# Altium schematic sheet WiFi.SchDoc
size A4; Organization: Protel International P/L; Address1: L3, 12a Rodborough Rd; Address2: Frenchs Forest; Address3: NSW; Address4: Australia 2086
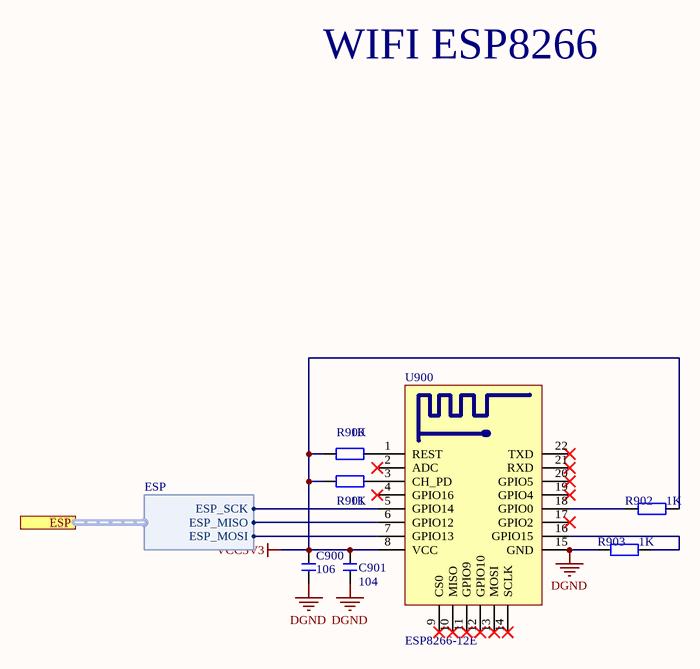
[diagram p0: WiFi.SchDoc]

## Parts
C900  106  [C 0402_M]
C901  104  [C 0402_M]
R900  1K  [R 0402_M]
R901  1K  [R 0402_M]
R902  1K  [R 0402_M]
R903  1K  [R 0402_M]
U900  ESP8266-12E  [ESP_12E]

## Ports
ESP (harness ESP)

## Harnesses
ESP: ESP_SCK, ESP_MISO, ESP_MOSI

## Nets
DGND: C900.1 C901.1 R903.1 U900.15(GND)
VCC3V3: C900.2 C901.2 R900.1 R901.1 R902.2 U900.8(VCC)
NetR900_2: R900.2 U900.1(REST)
NetR901_2: R901.2 U900.3(CH_PD)
NetR902_1: R902.1 U900.18(GPIO0)
NetR903_2: R903.2 U900.16(GPIO15)
NetU900_5: U900.5(GPIO14) ; port ESP.ESP_SCK
NetU900_6: U900.6(GPIO12) ; port ESP.ESP_MISO
NetU900_7: U900.7(GPIO13) ; port ESP.ESP_MOSI

Not connected (* = marked no-connect by the designer): U900 2(ADC)* 4(GPIO16)* 9(CS0)* 10(MISO)* 11(GPIO9)* 12(GPIO10)* 13(MOSI)* 14(SCLK)* 17(GPIO2)* 19(GPIO4)* 20(GPIO5)* 21(RXD)* 22(TXD)*

## Notes on the sheet
- WIFI ESP8266
- Title
- Size:
- Date:
- A4
- Number:
- Time:
- Revision:
- Sheet
- of
- File:

## Library data of the parts
C900 C901 = C: 无极性贴片电容; 版权归属: 源创客; BOM名称: 无极性贴片电容; 学习资源: www.ooocke.com
R900-R903 = R: 贴片电阻; 版权归属: 源创客; BOM名称: 贴片电阻; 学习资源: www.ooocke.com
U900 = ESP8266-12E: 串口 WIFI模块，ESP-12E; BOM名称: WIFI模块; 版权归属: 源创客; 学习资源: www.ooocke.com